# Altium schematic sheet SchemaA.SchDoc
size A3; Author: Meven Ricchieri; Organization: ETML-ES; Address1: Avenue Recordon 1; Address2: 1004 Lausanne; Address3: Switzerland; SheetNumber: 1; SheetTotal: 3; Version: 1.0.0; SPICEModelCacheKTVXVVLW: <root> / <DocumentId>KTVXVVLW</DocumentId> / <CacheFrame Number="0"> / <Model Name="gmk325bj226_m-p" Kind="CKT"> / <Text>* GMK325BJ226_M-P     SPICE MODEL  ( General Type ) / *-------------------------------------------------------------------------------------------------------- / * Model Generated by TAIYO YUDEN Corporation (http://www.ty-top.com) / * Version 1.0 / * TAIYO YUDEN Control No. 170508_130801 / * Copyright(c) 2013 TAIYO YUDEN CO.,LTD. All Rights Reserved. / *-------------------------------------------------------------------------------------------------------- / * / * Products Name : Multilayer Ceramic Capacitors / * / * Characteristics : / *     Capacitance : 22 uF , Rated Voltage : 35V , TCC : X5R / *     Case Size : 3.2 x 2.5 / 0.126 x 0.098 [mm/inch] , Thickness : 2.5 / 0.098 [mm/inch] / *     (Conditions: Temperature = 25 degC , DC Bias Current/Voltage = 0A / 0V) / * / * Frequency Range : 40Hz - 3GHz / * / * External Node Assignments : / * / *  1  o---| |---o  2 / * / *-------------------------------------------------------------------------------------------------------- / .SubCkt GMK325BJ226_M-P 1 2 / **************************** / C0 1 110 21.682u / Cm 1 101 0.91094u / C1 101 102 1.0899u / Rc1 101 102 553.17 / C2 102 103 0.9083u / Rc2 102 103 80.348 / C3 103 110 0.074532u / Rc3 103 110 13.175 / C2m 1 301 1.9433u / C21 301 302 3.2861u / Rc21 301 302 1.4311k / C22 302 303 5.4972u / Rc22 302 303 808.61 / C23 303 304 6.2914u / Rc23 303 304 347.32 / C24 304 305 1.4157u / Rc24 304 305 137.02 / C25 305 306 1.7642u / Rc25 305 306 48.416 / C26 306 307 0.53747u / Rc26 306 307 24.911 / C27 307 308 0.43531u / Rc27 307 308 19.314 / C28 308 309 0.14235u / Rc28 308 309 4.7266 / C29 309 110 0.014302u / Rc29 309 110 12.221 / Rp0 1 110 22.7272727272727Meg / L0 110 120 0.2195n / Lm 120 130 0.23424n / L1 120 121 0.14524n / RL1 121 130 82.951m / L2 120 122 0.3349n / RL2 122 130 56.388m / L3 120 123 0.40801n / RL3 123 130 28.34m / CR 120 124 3.7511u / LR 124 125 0.44285n / RR 125 130 10.325m / CL 130 140 4.5038p / LL 130 140 0.18078n / RL 130 140 26.028 / Rs 140 2 2.733m / **************************** / .ends GMK325BJ226_M-P</Text> / </Model> / </CacheFrame> / </root>
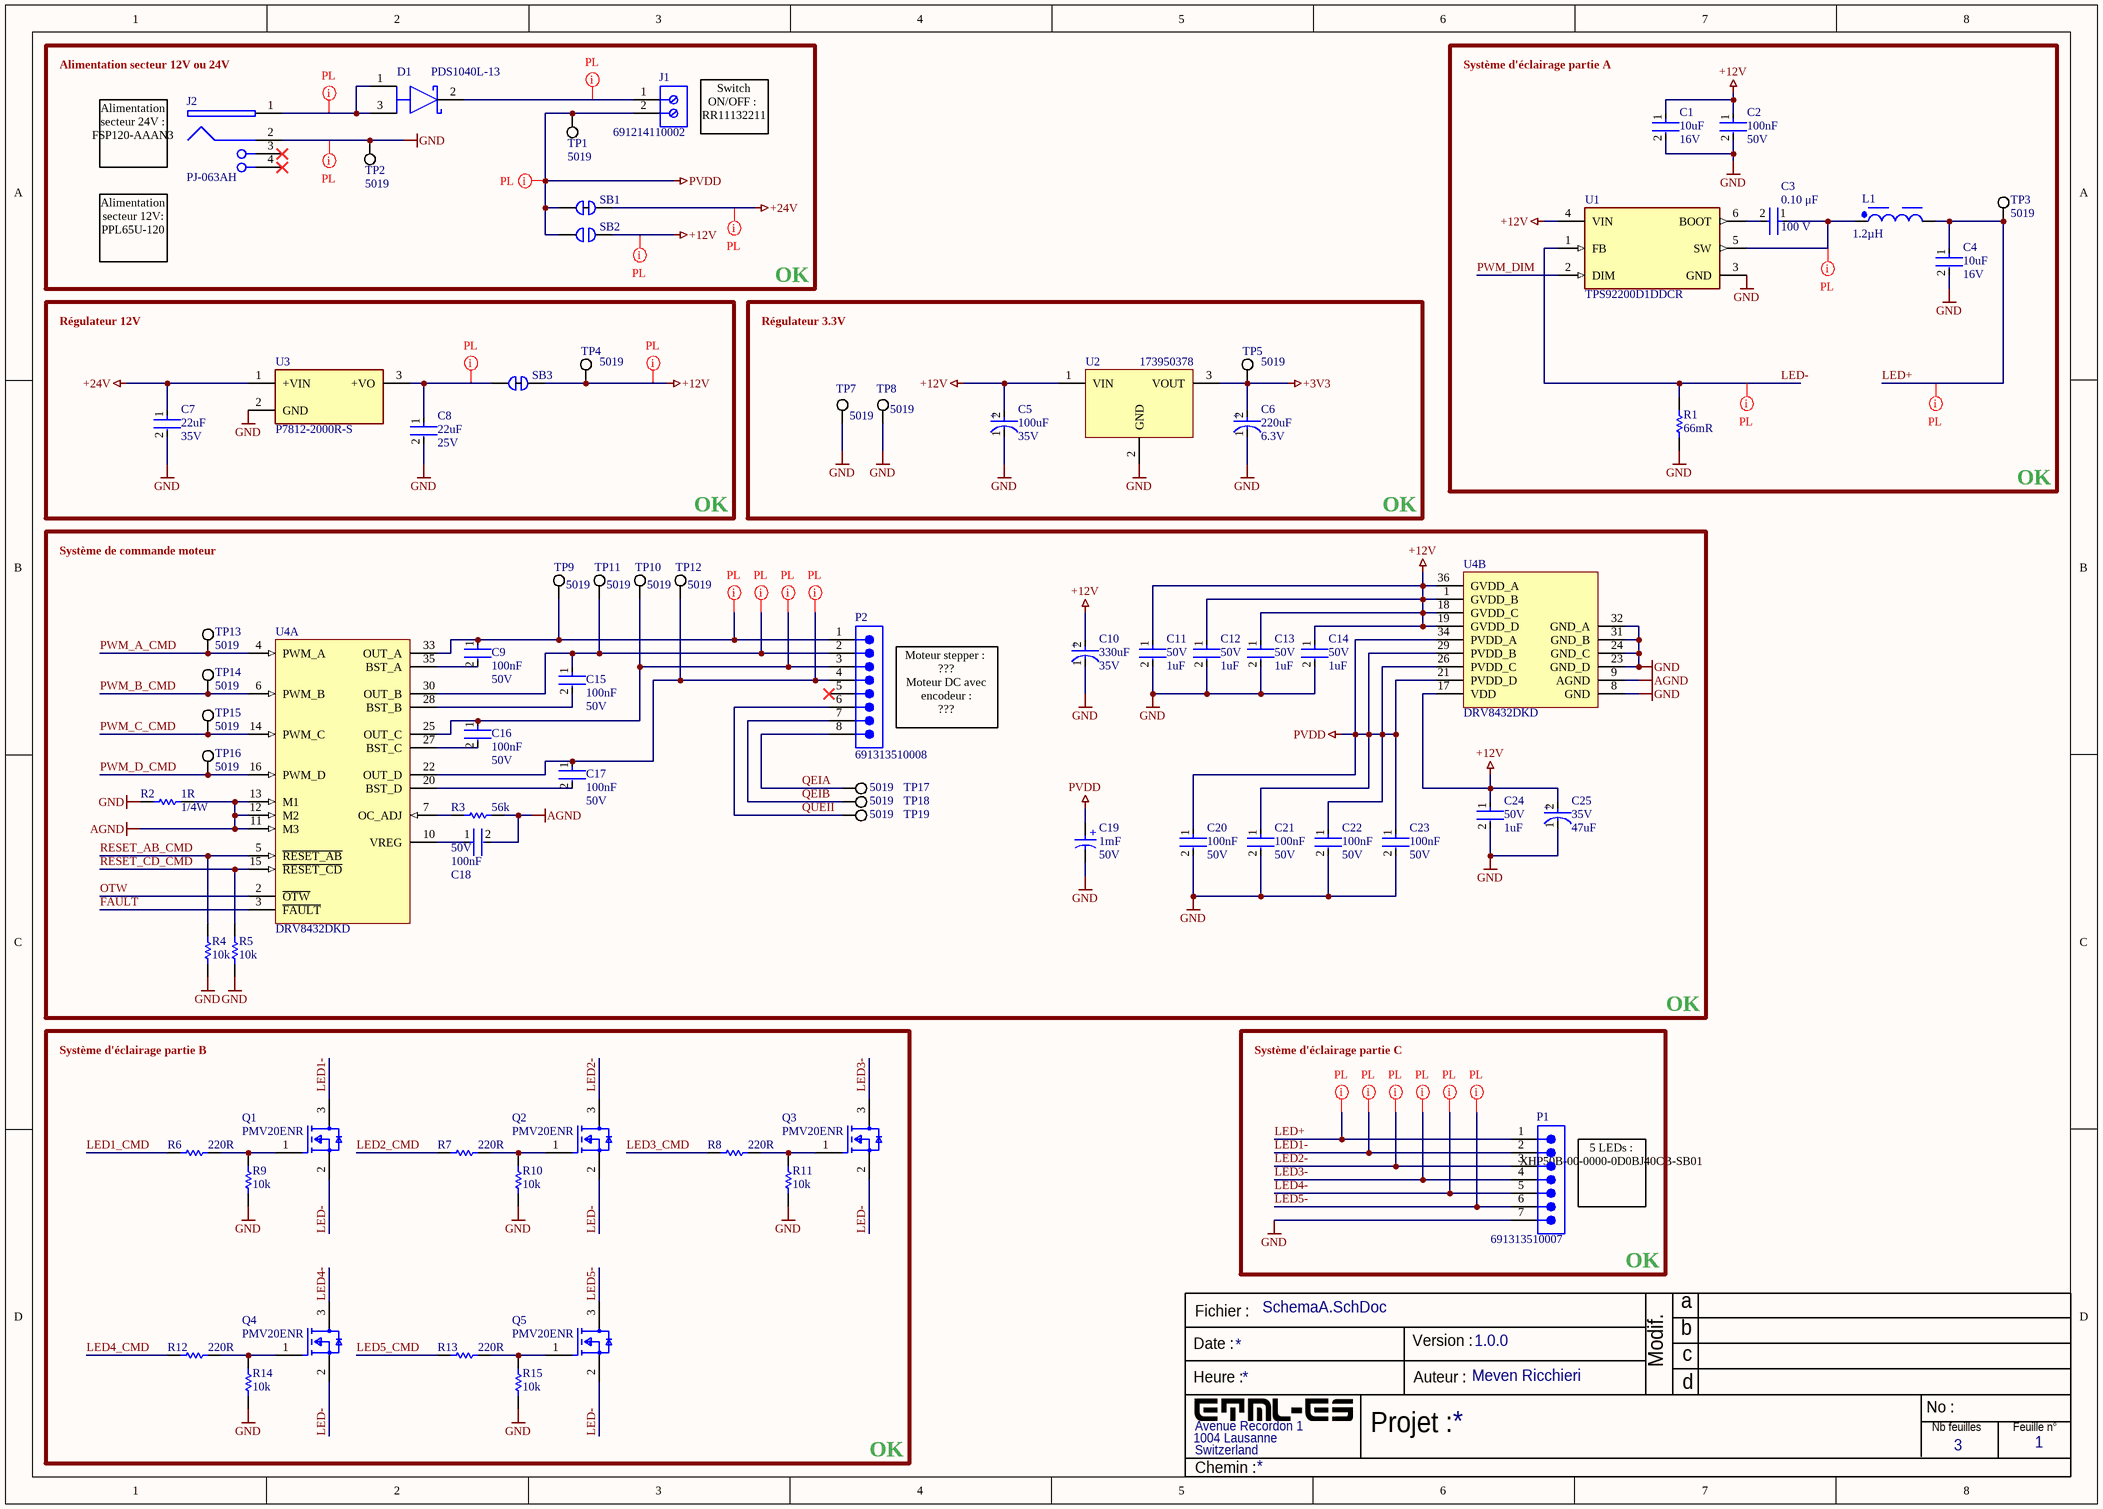
[diagram p0: SchemaA.SchDoc]

## Parts
C1  Capacitance: 10uF  Voltage Rating: 16V  [FP-CL21-IPC_B]  (hidden comment: CL21A106KOQNNNE)
C2  Capacitance: 100nF  Voltage Rating: 50V  [FP-CL21-IPC_C]  (hidden comment: CL21B104KBCNNNC)
C3  Capacitance: 0.10 μF  Voltage Rating: 100 V  [FP-C0805C-DN-MFG]  (hidden comment: C0805C104K1RACAUTO)
C4  Capacitance: 10uF  Voltage Rating: 16V  [FP-CL21-IPC_B]  (hidden comment: CL21A106KOQNNNE)
C5  Capacitance: 100uF  Voltage: 35V  [FP-SD8-MFG]  (hidden comment: EEE-1VA101XP)
C6  Voltage Rating: 6.3V  Capacitance: 220uF  [FP-FKD-MFG]  (hidden comment: EEE-FK0J221P)
C7  Capacitance: 22uF  Voltage Rating: 35V  [FP-1210-L_3_2_0_3-W_2_5_0-MFG]  (hidden comment: GMK325BJ226MM-P)
C8  value 22uF  Voltage: 25V  [FP-CL21-IPC_C]  (hidden comment: CL21A226MAYNNNE)
C9  Capacitance: 100nF  Voltage Rating: 50V  [FP-CL21-IPC_C]  (hidden comment: CL21B104KBCNNNC)
C10  Voltage: 35V  Capacitance: 330uF  [FP-SG-MFG]  (hidden comment: EEE-1VA331P)
C11  Capacitance: 1uF  Voltage: 50V  [FP-CL21-IPC_C]  (hidden comment: CL21B105KBFNNNG)
C12  Capacitance: 1uF  Voltage: 50V  [FP-CL21-IPC_C]  (hidden comment: CL21B105KBFNNNG)
C13  Capacitance: 1uF  Voltage: 50V  [FP-CL21-IPC_C]  (hidden comment: CL21B105KBFNNNG)
C14  Capacitance: 1uF  Voltage: 50V  [FP-CL21-IPC_C]  (hidden comment: CL21B105KBFNNNG)
C15  Capacitance: 100nF  Voltage Rating: 50V  [FP-CL21-IPC_C]  (hidden comment: CL21B104KBCNNNC)
C16  Capacitance: 100nF  Voltage Rating: 50V  [FP-CL21-IPC_C]  (hidden comment: CL21B104KBCNNNC)
C17  Capacitance: 100nF  Voltage Rating: 50V  [FP-CL21-IPC_C]  (hidden comment: CL21B104KBCNNNC)
C18  Capacitance: 100nF  Voltage Rating: 50V  [FP-CL21-IPC_C]  (hidden comment: CL21B104KBCNNNC)
C19  Capacitance: 1mF  Voltage Rating: 50V  [WCAP-ASLI_D16H17]  (hidden comment: 865080663020)
C20  Capacitance: 100nF  Voltage Rating: 50V  [FP-CL21-IPC_C]  (hidden comment: CL21B104KBCNNNC)
C21  Capacitance: 100nF  Voltage Rating: 50V  [FP-CL21-IPC_C]  (hidden comment: CL21B104KBCNNNC)
C22  Capacitance: 100nF  Voltage Rating: 50V  [FP-CL21-IPC_C]  (hidden comment: CL21B104KBCNNNC)
C23  Capacitance: 100nF  Voltage Rating: 50V  [FP-CL21-IPC_C]  (hidden comment: CL21B104KBCNNNC)
C24  Capacitance: 1uF  Voltage: 50V  [FP-CL21-IPC_C]  (hidden comment: CL21B105KBFNNNG)
C25  Voltage Rating (DC): 35V  Capacitance: 47uF  [FP-FPD-MFG]  (hidden comment: EEEFP1V470AP)
D1  PDS1040L-13  [FP-PowerDI5-MFG]
J1  691214110002  [691214110002]
J2  PJ-063AH  [CUI-PJ-063AH_V]
L1  Inductance: 1.2µH  [WE-TPC_4828]  (hidden comment: 7440430012)
P1  691313510007  [691313510007]
P2  691313510008  [691313510008]
Q1  PMV20ENR  [FP-SOT23-MFG]
Q2  PMV20ENR  [FP-SOT23-MFG]
Q3  PMV20ENR  [FP-SOT23-MFG]
Q4  PMV20ENR  [FP-SOT23-MFG]
Q5  PMV20ENR  [FP-SOT23-MFG]
R1  value 66mR  [6-0805_M]  (hidden comment: ERJ-L06UF66MV)
R2  value 1R  Power: 1/4W  [RESC2013X60X30NL20T20]  (hidden comment: RK73B2ATTD1R0J)
R3  value 56k  [RESC2013X70X40NL20T20]  (hidden comment: ERJ6ENF5602V)
R4  Resistance: 10k  [RESC2013X60X35ML10T20]  (hidden comment: RC0805JR-0710KL)
R5  Resistance: 10k  [RESC2013X60X35ML10T20]  (hidden comment: RC0805JR-0710KL)
R6  value 220R  [RESC2013X70X40NL20T20]  (hidden comment: ERJ6ENF2200V)
R7  value 220R  [RESC2013X70X40NL20T20]  (hidden comment: ERJ6ENF2200V)
R8  value 220R  [RESC2013X70X40NL20T20]  (hidden comment: ERJ6ENF2200V)
R9  Resistance: 10k  [RESC2013X60X35ML10T20]  (hidden comment: RC0805JR-0710KL)
R10  Resistance: 10k  [RESC2013X60X35ML10T20]  (hidden comment: RC0805JR-0710KL)
R11  Resistance: 10k  [RESC2013X60X35ML10T20]  (hidden comment: RC0805JR-0710KL)
R12  value 220R  [RESC2013X70X40NL20T20]  (hidden comment: ERJ6ENF2200V)
R13  value 220R  [RESC2013X70X40NL20T20]  (hidden comment: ERJ6ENF2200V)
R14  Resistance: 10k  [RESC2013X60X35ML10T20]  (hidden comment: RC0805JR-0710KL)
R15  Resistance: 10k  [RESC2013X60X35ML10T20]  (hidden comment: RC0805JR-0710KL)
SB1  Solder bridge 3mm close  [Solder bridge]  (value not drawn)
SB2  Solder bridge 3mm open  [Solder bridge]  (value not drawn)
SB3  Solder bridge 3mm close  [Solder bridge]  (value not drawn)
TP1  5019  [KSTN-5019_V]
TP2  5019  [KSTN-5019_V]
TP3  5019  [KSTN-5019_V]
TP4  5019  [KSTN-5019_V]
TP5  5019  [KSTN-5019_V]
TP7  5019  [KSTN-5019_V]
TP8  5019  [KSTN-5019_V]
TP9  5019  [KSTN-5019_V]
TP10  5019  [KSTN-5019_V]
TP11  5019  [KSTN-5019_V]
TP12  5019  [KSTN-5019_V]
TP13  5019  [KSTN-5019_V]
TP14  5019  [KSTN-5019_V]
TP15  5019  [KSTN-5019_V]
TP16  5019  [KSTN-5019_V]
TP17  5019  [KSTN-5019_V]
TP18  5019  [KSTN-5019_V]
TP19  5019  [KSTN-5019_V]
U1  TPS92200D1DDCR  [FP-DDC0006A-MFG]
U2  173950378  [WPME-FDSM_SIP-3_L11.6W8.5H10.5]
U3  P7812-2000R-S  [P7812-2000R-S]
U4  DRV8432DKD  [SOP65P1420X360-36N]  (parts A,B of 2)

## Blocks framed on the sheet
OK: D1 J1 J2 SB1 SB2 TP1 TP2
OK: C1-C4 L1 R1 TP3 U1
OK: C7 C8 SB3 TP4 U3
OK: Q1-Q5 R6-R15

## Nets
+3V3: C6.2(A) TP5.1 U2.3(VOUT)
+12V: C1.1 C2.1 C5.2(A) C10.2(A) C11.1 C12.1 C13.1 C14.1 C24.1 C25.2(A) SB2.2 SB3.2 TP4.1 U1.4(VIN) U2.1(VIN) U4.1(GVDD_B) U4.17(VDD) U4.18(GVDD_C) U4.19(GVDD_D) U4.36(GVDD_A)
+24V: C7.1 SB1.2 U3.1(+VIN)
AGND: C18.2 R2.2 R3.2 U4.9(AGND) U4.11(M3) U4.12(M2) U4.13(M1)
GND: C1.2 C2.2 C4.2 C5.1(C) C6.1(C) C7.2 C8.2 C10.1(C) C11.2 C12.2 C13.2 C14.2 C19.2(N) C20.2 C21.2 C22.2 C23.2 C24.2 C25.1(C) J2.2 P1.7 R1.1 R2.1 R4.1 R5.1 R9.1 R10.1 R11.1 R14.1 R15.1 TP2.1 TP7.1 TP8.1 U1.3(GND) U2.2(GND) U3.2(GND) U4.8(GND) U4.23(GND_D) U4.24(GND_C) U4.31(GND_B) U4.32(GND_A)
PVDD: C19.1(P) C20.1 C21.1 C22.1 C23.1 J1.2 SB1.1 SB2.1 TP1.1 U4.21(PVDD_D) U4.26(PVDD_C) U4.29(PVDD_B) U4.34(PVDD_A)
FAULT: U4.3(~{FAULT})
LED1-: P1.2 Q1.3(D)
LED1_CMD: R6.1
LED2-: P1.3 Q2.3(D)
LED2_CMD: R7.1
LED3-: P1.4 Q3.3(D)
LED3_CMD: R8.1
LED4-: P1.5 Q4.3(D)
LED4_CMD: R12.1
LED5-: P1.6 Q5.3(D)
LED5_CMD: R13.1
LED+: C4.1 L1.2 P1.1 TP3.1
LED-: Q1.2(S) Q2.2(S) Q3.2(S) Q4.2(S) Q5.2(S) R1.2 U1.1(FB)
OTW: U4.2(~{OTW})
PWM_A_CMD: TP13.1 U4.4(PWM_A)
PWM_B_CMD: TP14.1 U4.6(PWM_B)
PWM_C_CMD: TP15.1 U4.14(PWM_C)
PWM_D_CMD: TP16.1 U4.16(PWM_D)
PWM_DIM: U1.2(DIM)
QEIA: P2.8 TP17.1
QEIB: P2.7 TP18.1
QUEII: P2.6 TP19.1
RESET_AB_CMD: R4.2 U4.5(~{RESET_AB})
RESET_CD_CMD: R5.2 U4.15(~{RESET_CD})
NetC3_1: C3.1 L1.1 U1.5(SW)
NetC3_2: C3.2 U1.6(BOOT)
NetC8_1: C8.1 SB3.1 U3.3(+VO)
NetC9_1: C9.1 P2.1 TP9.1 U4.33(OUT_A)
NetC9_2: C9.2 U4.35(BST_A)
NetC15_1: C15.1 P2.2 TP11.1 U4.30(OUT_B)
NetC15_2: C15.2 U4.28(BST_B)
NetC16_1: C16.1 P2.3 TP10.1 U4.25(OUT_C)
NetC16_2: C16.2 U4.27(BST_C)
NetC17_1: C17.1 P2.4 TP12.1 U4.22(OUT_D)
NetC17_2: C17.2 U4.20(BST_D)
NetC18_1: C18.1 U4.10(VREG)
NetD1_1: D1.1(A) D1.3(A) J2.1
NetD1_2: D1.2(C) J1.1
NetQ1_1: Q1.1(G) R6.2 R9.2
NetQ2_1: Q2.1(G) R7.2 R10.2
NetQ3_1: Q3.1(G) R8.2 R11.2
NetQ4_1: Q4.1(G) R12.2 R14.2
NetQ5_1: Q5.1(G) R13.2 R15.2
NetR3_1: R3.1 U4.7(OC_ADJ)

Not connected (* = marked no-connect by the designer): J2 3(SHLD)* 4(SHLD)*; P2 5*

## Layout directives
net class PowerLine: +12V, +24V, GND, LED1-, LED2-, LED3-, LED4-, LED5-, LED+, LED-, NetC3_1, NetC8_1, NetC9_1, NetC15_1, NetC16_1, NetC17_1, NetD1_1, NetD1_2, PVDD

## Notes on the sheet
- (near J2) Alimentation secteur 12V ou 24V
- Système d'éclairage partie A
- Alimentation secteur 24V :
  FSP120-AAAN3
- (near J1) Switch ON/OFF :
  RR11132211
- Alimentation secteur 12V:
  PPL65U-120
- Régulateur 12V
- Régulateur 3.3V
- OK
- Système de commande moteur
- (near P2) Moteur stepper :
  ???
  Moteur DC avec encodeur :
  ???
- Système d'éclairage partie B
- Système d'éclairage partie C
- (near P1) 5 LEDs :
  XHP50B-00-0000-0D0BJ40CB-SB01
- Fichier :
- a
- Date :
- Heure :
- Version :
- Auteur :
- Modif.
- b
- c
- d
- Projet :
- No :
- Nb feuilles
- Feuille n°
- Chemin :
- (in symbol CMP-2000-06216-2) +
- (in symbol CMP-03913-53914628-1) +
- (in symbol CMP-05427-000053-1) +
- (in symbol CMP-05427-000062-1) +
- (in symbol CMP-05427-002166-1) +

## Library data of the parts
C1 C4 = CMP-2000-06102-2: CL21 Series 0805 10uF 16V ±10% Tolerance X5R Multilayer Ceramic Chip Capacitor; Dielectric: X7R; Length: 2mm; Depth: 1.25mm; Voltage: 16V; Width: 0.049inch; Lead Free: Lead Free; Max Operating Temperature: 85°C; Mount: Surface Mount; Height: 1.25mm; Radiation Hardening: No; Packaging: Tape and Reel; Voltage Rating (DC): 16V; Thickness: 0.055inch; Case/Package: 0805; Case Code (Imperial): 0805; Min Operating Temperature: -55°C; Case Code (Metric): 2012; Package Quantity: 1; Tolerance: 10%
C2 C9 C15-C18 C20-C23 = CMP-2000-05017-2: CL21 Series 0805 100nF 50V ±10% Tolerance X7R Multilayer Ceramic Chip Capacitor; Depth: 1.25mm; Height: 0.85mm; Width: 0.049inch; Tolerance: 10%; Case Code (Metric): 2012; Case Code (Imperial): 0805; Material: Ceramic; Thickness: 0.037inch; Min Operating Temperature: -55°C; Contact Plating: Tin; Length: 2mm; Mount: Surface Mount; Voltage Rating (DC): 50V; Lead Free: Lead Free; Dielectric: X7R; Radiation Hardening: No; Case/Package: 0805; Packaging: Tape and Reel; Max Operating Temperature: 125°C; Voltage: 50V
C3 = CMP-2007-03648-2: CAP CER 0.1UF 100V X7R 0805; Manufacturer: KEMET; Temperature Coefficient: 30ppm/°C; Material: Ceramic; Tolerance: 0.1; Value: 0.10 μF; Category: Cap; Temperature: -55°C to +125°C; ComponentLink2Description: Datasheet; Temperature Range Low: -55°C; Device Class L2: Capacitors; ComponentLink2URL: https://content.kemet.com/datasheets/KEM_C1003_C0G_SMD.pdf; Ipc Land Pattern Name: CAPC200125X78; Temperature Range High: +125°C; Package: C0805C-DN; Temperature Characteristic: X7R; Height: 0.88mm; Digikey Description: CAP CER 0.1UF 100V X7R 0805; Device Class L3: Ceramic Capacitors; Manufacturer Part Number: C0805C104K1RACAUTO; Device Class L1: Passive Components; Lead Free: Yes; RoHS: TRUE; Automotive: No; Octopart: https://octopart.com/c0805c104k1racauto-kemet-12625098
C5 = CMP-05427-000062-1: CAP ALUM 100UF 20% 35V SMD; Ripple Current (AC): 132mA; Leakage Current: 3uA; Life (Hours): 2000Hour; Polarity: Polar; Lead Free: Lead Free; REACH SVHC: No SVHC; Number of Pins: 8; Contact Plating: Tin; Construction: Cylindrical; Min Operating Temperature: -40°C; Tolerance: 20%; Mount: Surface Mount; Series: S; Radiation Hardening: No; Package Quantity: 900; RoHS Compliant: Yes; Case/Package: Radial; Height - Seated (Max): 0.303inch; Voltage Rating: 35V; Voltage Rating (DC): 35V; Length: 8mm; Height: 7.7mm; Max Operating Temperature: 85°C; Packaging: Tape and Reel; Termination: SMD/SMT; Ripple Current: 132mA; Diameter: 6.3mm
C6 = CMP-05427-000053-1: CAP ALUM 220UF 20% 6.3V SMD; Material: Aluminium; Leakage Current: 3uA; Ripple Current: 240mA; ESR (Equivalent Series Resistance): 360mR; Polarity: Polar; Life (Hours): 2000Hour; Case/Package: Radial; Packaging: Tape and Reel; Height - Seated (Max): 0.24inch; Construction: Cylindrical; Radiation Hardening: No; Number of Pins: 2; Diameter: 6.3mm; Width: 7.8mm; Length: 5.8mm; Ripple Current (AC): 240mA; Voltage: 6.3V; Height: 5.8mm; Termination: SMD/SMT; Series: FK; Contact Plating: Tin; Mount: Surface Mount; Voltage Rating (DC): 6.3V; Size: 5.8mm; Min Operating Temperature: -55°C; Package Quantity: 1000; Tolerance: 20%; REACH SVHC: No SVHC; Impedance: 360mR; Lead Free: Lead Free; RoHS Compliant: Yes; Max Operating Temperature: 105°C
C7 = CMP-14477-001772-2: None; Tolerance: 20%; Lead Free: Lead Free; Packaging: Cut Tape; Case/Package: 1210; Max Operating Temperature: 85°C; Case Code (Metric): 3225; Min Operating Temperature: -55°C; Case Code (Imperial): 1210; RoHS Compliant: Yes; Mount: Surface Mount
C8 = CMP-13271-003225-1: CL21 Series 0805 22uF 25V ±20% Tolerance X5R Multilayer Ceramic Chip Capacitor
C10 = CMP-05427-002166-1: CAP ALUM 330UF 20% 35V SMD; Ripple Current (AC): 350mA; Life (Hours): 2000Hour; Leakage Current: 3uA; Polarity: Polar; Termination: SMD/SMT; Case/Package: Radial; Radiation Hardening: No; Package Quantity: 500; Tolerance: 20%; Mount: Surface Mount; Height: 10.2mm; Packaging: Tape and Reel; Lead Free: Lead Free; Diameter: 10mm; RoHS Compliant: Yes; Ripple Current: 350mA; Ratings: AEC-Q200; Reach SVHC Compliant: Yes; Min Operating Temperature: -40°C; Contact Plating: Tin; Construction: Cylindrical; Max Operating Temperature: 85°C; Voltage Rating (DC): 35V; Height - Seated (Max): 0.402inch; Series: S; Length: 10.5mm; Voltage Rating: 35V
C11-C14 C24 = CMP-13271-001433-1: CL21 Series 0805 1uF 50V ±10% Tolerance X7R Multilayer Ceramic Chip Capacitor; Case Code (Metric): 2012; Max Operating Temperature: 125°C; Termination: Wraparound; Min Operating Temperature: -55°C; Packaging: Tape and Reel; Contact Plating: Tin; Case/Package: 0805; Depth: 1.25mm; Case Code (Imperial): 0805; Mount: Surface Mount; Material: Ceramic; Tolerance: 10%; Thickness: 0.053inch; Package Quantity: 3000; Voltage Rating: 50V; Width: 0.049inch; Length: 2mm; Dielectric: X7R
C19 = CMP-03913-53914628-1: 865080663020 WCAP-ASLI Aluminum Electrolytic Capacitors; Ripple Current: 1A; Tolerance: 20%; Life (Hours): 2000hours; ESR (Equivalent Series Resistance): 60.8615mΩ; Leakage Current: 500µA; Insulation Resistance: 100kΩ; Impedance: 78mΩ; Polarity: Polar; RoHS: Compliant; NexarPartId: 53914628; Width: 17.1mm; Height: 17mm; Diameter: 16mm; Mount: Surface Mount; Min Operating Temperature: -55°C; Ripple Current (AC): 1A; Max Operating Temperature: 105°C; Voltage Rating (DC): 50V; REACH SVHC: Unknown; Length: 17mm; Case/Package: Radial; Packaging: Tape & Reel (TR); Height - Seated (Max): 16.9926mm
C25 = CMP-2000-06216-2: CAP ALUM 47UF 20% 35V SMD; Life (Hours): 2000Hour; Leakage Current: 3uA; Dissipation Factor: 0.12%; Material: Aluminium; Ripple Current (AC): 300mA; ESR (Equivalent Series Resistance): 260mR; Construction: Cylindrical; Contact Plating: Tin; Termination: SMD/SMT; RoHS Compliant: Yes; Package Quantity: 1; Tolerance: 20%; Mount: Surface Mount; Diameter: 6.3mm; Lead Free: Lead Free; Number of Pins: 2; Radiation Hardening: No; Series: FP; REACH SVHC: No SVHC; Length: 5.8mm; Height - Seated (Max): 0.228inch; Packaging: Tape and Reel; Voltage Rating: 35V; Min Operating Temperature: -55°C; Voltage: 35V; Case/Package: Radial; Max Operating Temperature: 105°C; Ripple Current: 300mA; Height: 5.8mm; Lead Pitch: 1.8mm
D1 = CMP-12790-000057-1: DIODE SCHOTTKY 40V 10A POWERDI5; Manufacturer: Diodes Inc.; Max Junction Temp: +150°C; Standoff Height: 0mm; Automotive Grade: Grade 0; Peak Reverse Current: 0.07mA; Max Surge Forward Current: 275A; Temperature Range Low: -65°C; Digikey Description: DIODE SCHOTTKY 40V 10A POWERDI5; Lead Free: Yes; Device Class L3: Schottky Diodes; Forward Current: 10A; ComponentLink2Description: Datasheet; Device Class L2: Diodes; Octopart: https://octopart.com/pds1040l-13-diodes+inc.-332540; Device Class L1: Discrete Semiconductors; Footprint Url: https://www.diodes.com/assets/Package-Files/PowerDI5.pdf; Automotive: Yes; Temperature Range High: +150°C; Mouser Description: PDS1040L Series 40 V 10 A Low VF Schottky Barrier Rectifier - PowerDI? 5; Temperature: -65°C to +150°C; RoHS: TRUE; ComponentLink2URL: https://www.diodes.com/assets/Datasheets/ds30486.pdf; Reverse Voltage: 40V; Height: 1.15mm; Manufacturer Part Number: PDS1040L-13; Package: PowerDI5; Max Repetitive Reverse Voltage: 40V; Category: Diode
J1 = CMP-1502-02464-2: NexarPartId: 18818288; Plating: Brass, Steel; Current: 10A; Pitch: 3.5052mm; Number of Levels: 1; Number of Contacts: 2; Wire Gauge (Min): 16AWG; Voltage: 300V; Wire Gauge (Max): 24AWG; Stripping Length: -6mm; Number of Pins: 2; Number of Rows: 1; REACH SVHC: Unknown; RoHS: Compliant; Housing Material: Nylon; Termination: Screw; Mount: Through Hole; Contact Plating: Brass, Tin; Number of Positions Per Level: 2; Color: Blue, Green; Width: 7.9mm; Voltage Rating: 300V; Length: 7.4mm; Current Rating: 10A; Wire/Cable Gauge: 24AWG; Packaging: Box; Max Operating Temperature: 105°C; Lead Pitch: 3.5mm; Height: 8.7mm; Contact Material: Brass; Min Operating Temperature: -40°C
J2 = CMP-2000-06898-1: Through Hole Right Angle DC Power Jack, 8 A, 2 mm Center Pin, 2 Position, -25 to 85 degC, RoHS, Bulk; Manufacturer: CUIInc.; Voltage Rating: 24V; Current Rating: 8A; Inside Contact Diameter: 2mm; Insulation Resistance: 100MOhms; Outside Contact Diameter: 6.5mm; Brand: CUI; Termination Style: ThroughHole; Flammability Rating: UL94V-0; Datasheet Version: Rev. 1.02, 03/2016; Manufacturer URL: http://www.cui.com/; Product Category: DCPowerConnectors; Package Description: 2-Pin Through Hole Device, Body 13 x 10 mm, Height 9 mm; Connector Type: DCPowerJack; Factory Pack Quantity: 500; Contact Plating: Nickel; Mounting Style: KinkedPin; Contact Material: Copper; RoHS: True; Mounting Angle: Right; Package Reference: PJ-063AH; Product: Jacks; Contact Gender: Male; Datasheet URL: http://www.cui.com/product/resource/pj-063ah.pdf; Housing Material: PolybutyleneTerephthalate(PBT); Mounting Technology: ThroughHole; Operating Temperature Range: -25Cto+85C
L1 = CMP-0227-00340-3: NexarPartId: 8917077; Resistance: 17mΩ; Core Material: Ferrite; Self Resonant Frequency: 150MHz; Tolerance: 30%; Saturation Current: 2.8A; Test Frequency: 100kHz; RMS Current (Irms): 3.1A; Shielding: Shielded; Ambient Temperature Range High: 95°C; Case/Package: 1919; Width: 4.8mm; Max Operating Temperature: 125°C; DC Resistance (DCR): 17mΩ; Height: 2.8mm; Height - Seated (Max): 2.9972mm; Packaging: Cut Tape (CT); Case Code (Imperial): 1919; REACH SVHC: Unknown; Current Rating: 3.1A; Weight: 256.988427mg; Composition: Wirewound; Depth: 4.8mm; Mount: Surface Mount; Max DC Current: 3.1A; Min Operating Temperature: -40°C; RoHS: Compliant; Termination: SMD/SMT; Length: 4.8mm; Number of Pins: 2; Lead Free: Lead Free; Inductance Tolerance: 30%; Ambient Temperature Range Low: -40°C; Case Code (Metric): 4848
P1 = CMP-1502-02197-2: NexarPartId: 105951014
P2 = CMP-1502-02198-2: NexarPartId: 8917764; Current: 20A; Voltage: 300V; Number of Positions Per Level: 8; Number of Levels: 1; Gender: Male; Pitch: 5.08mm; Width: 42.64mm; Color: Green; Mount: Through Hole; Contact Plating: Tin; Packaging: Box; Length: 11.5mm; Current Rating: 20A; Number of Contacts: 8; RoHS: Compliant; Lead Pitch: 5.08mm; Contact Material: Brass; REACH SVHC: No SVHC; Height: 12mm; Number of Rows: 1; Contact Gender: Male; Termination: Solder; Number of Pins: 8
Q1-Q5 = CMP-14409-000013-1: MOSFET N-CH 30V SOT23
R1 = Res1: Resistor; Published: 8-Jun-2000; LatestRevisionDate: 17-Jul-2002; LatestRevisionNote: Re-released for DXP Platform.; PackageReference: AXIAL-0.3; Publisher: Altium Limited; PackageDescription: Axial Device, Thru-Hole; 2 Leads; 0.3 in Pin Spacing
R2 = CMP-2001-01793-1: Manufacturer: KOA Speer; Part Number: RK73B2ATTD1R0J
R3 = CMP-2001-00559-1: Manufacturer: Panasonic; Part Number: ERJ6ENF5602V
R4 R5 R9-R11 R14 R15 = CMP-2000-05025-1: Chip Resistor, 10 KOhm, +/- 5%, 0.125 W, -55 to 155 degC, 0805 (2012 Metric), RoHS, Tape and Reel; Manufacturer: Yageo; Resistor Element Type: ThickFilm; Voltage Rating: 150V; Product Range: RCSeries; SVHC: ToBeAdvised; Resistor Case Style: 0805[2012Metric]; Temperature Coefficient: ±100ppm/degC; Power Rating: 250mW; Automotive Qualification Standard: -; Datasheet Version: REV. 2, 09/2004; Packaging: CutTape; Resistance Tolerance: ±5%; MSL: MSL1-Unlimited; Manufacturer URL: http://www.yageo.com/; Datasheet URL: http://www.yageo.ru/pdf/RC0805.pdf; Package Description: 2-Pin Surface Mounted Device, Body 2 x 1.25 mm; Package Reference: 805
R6-R8 R12 R13 = CMP-2001-00044-1: Manufacturer: Panasonic; Part Number: ERJ6ENF2200V
TP1-TP5 TP7-TP19 = CMP-1672-00008-1: Test Point, 1 Position SMD, RoHS, Tape and Reel; ComponentLink1Description: Manufacturer URL; Package Quantity: 1000; DatasheetVersion: 03/2014; Packaging: Tape and Reel; ComponentLink2URL: http://www.keyelco.com/product-pdf.cfm?p=1357; ComponentLink1URL: http://www.keyelco.com/; Mount: Surface Mount; Contact Plating: Silver; PackageDescription: 1-Pin Surface Mount Device, Body 3.81 x 2.03 mm; Pins: 1; RoHSCompliant: True; Mounting Technology: Surface Mount; ComponentLink2Description: Datasheet; PackageReference: 5019
U1 = CMP-04914-000046-1
U2 = CMP-03913-65436605-1: 173950378 Module DC-DC 1-OUT 3.3V 0.5A 3-Pin SIP Module Tube; Output Power: 1.65W; Max Input Voltage: 28V; Number of Outputs: 1; Min Input Voltage: 6V; Switching Frequency: 570kHz; Max Output Current: 500mA; Efficiency: 95%; Output Type: Fixed; RoHS: Compliant; Features: OTP, OVP, SCP; REACH SVHC: Unknown; Width: 8.5mm; Length: 11.6mm; Min Operating Temperature: -40°C; Case/Package: Module; Output Voltage: 3.3V; Max Power Dissipation: 1.65W; NexarPartId: 65436605; Number of Pins: 3; Voltage - Output 1: 3.3V; Max Operating Temperature: 85°C; Max Switching Frequency: 570kHz; Max Output Voltage: 3.3V; Height: 10.5mm; Mount: Through Hole; Output Current: 500mA; Nominal Output Voltage: 3.3V
U4 = DRV8432DKD: 12 A Dual Brushed DC or Single Bipolar Stepper Motor Driver (PWM Ctrl), 0 to 52.5 V, -40 to 85 degC, 36-pin SOP (DKD36), Green (RoHS & no Sb/Br); Vs(Max)(V): 52.5; RMS Output Current(A): 7; Peak Output Current(A): 12; Vs(Min)(V): 0; rDS (ON) (LS + HS)(mOhms): 220; Package Reference: DKD0036A; PackageVersion: 4204421-2/K, 11/2013; Mounting Technology: Surface Mount; PackageDescription: 36-Pin Plastic Small Outline, Body 15.9 x 11 mm, Pitch 0.65 mm; PartNumber: DRV8432DKD; DatasheetVersion: SLES242D; ComponentLink3Description: Package Specification; ComponentLink1URL: http://www.ti.com/; Control I/F: PWM; ComponentLink1Description: Manufacturer URL; ComponentLink2Description: Datasheet; Eco-Plan: Green (RoHS & no Sb/Br); ComponentLink2URL: http://www.ti.com/general/docs/lit/getliterature.tsp?genericPartNumber=DRV8432&fileType=pdf; ComponentLink3URL: http://www.ti.com/lit/ml/mpds126j/mpds126j.pdf